# Altium schematic sheet 03_GYROSCOPE.SchDoc: GYRO
size A4; Author: Gabriel; Organization: Altium Limited; Address1: L3, 12a Rodborough Rd; Address2: Frenchs Forest; Address3: NSW; Address4: Australia 2086; Revision: v2.0; SheetNumber: 3; SheetTotal: 8; Subtitle: XDRONE
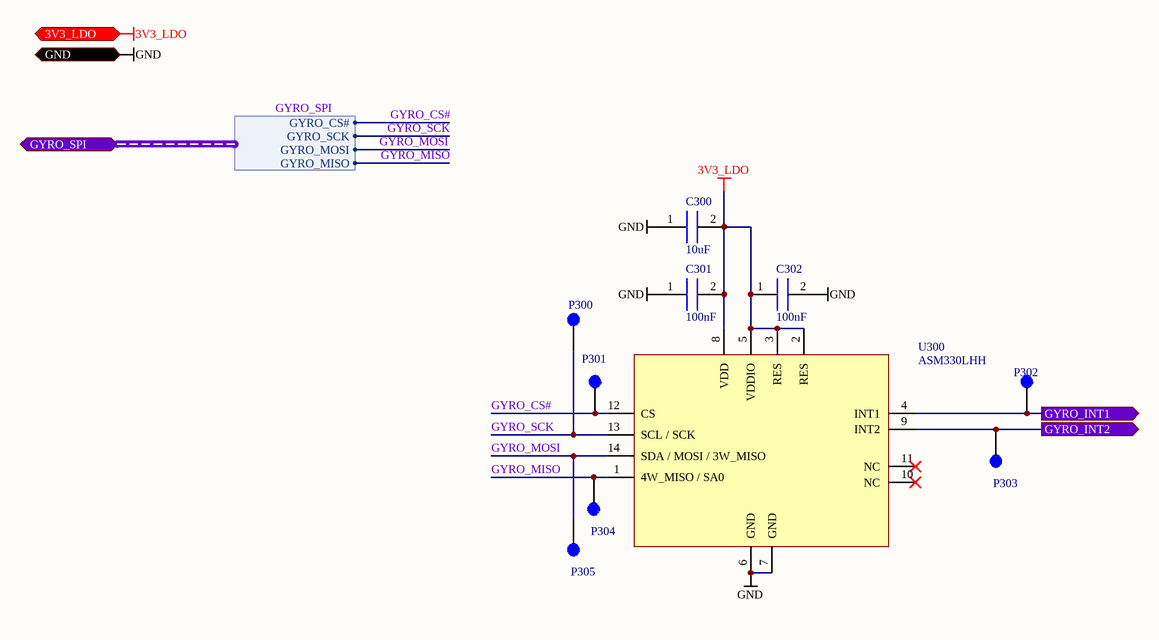
[diagram p0: 03_GYROSCOPE.SchDoc]

## Parts
C300  value 10uF  [CAP_0402]  (hidden comment: 10uF_20%_6.3V_0402_GRM155R60J106ME05D)
C301  value 100nF  [CAP_0402]  (hidden comment: 100nF_10%_16V_0402_GRM155R71C104KA88J)
C302  value 100nF  [CAP_0402]  (hidden comment: 100nF_10%_16V_0402_GRM155R71C104KA88J)
P300  TEST_POINT_2mm  [TEST_POINT_2mm]  (value not drawn)
P301  TEST_POINT_2mm  [TEST_POINT_2mm]  (value not drawn)
P302  TEST_POINT_2mm  [TEST_POINT_2mm]  (value not drawn)
P303  TEST_POINT_2mm  [TEST_POINT_2mm]  (value not drawn)
P304  TEST_POINT_2mm  [TEST_POINT_2mm]  (value not drawn)
P305  TEST_POINT_2mm  [TEST_POINT_2mm]  (value not drawn)
U300  MANUFACTURER REFERENCE: ASM330LHH  [LGA14]  (hidden comment: GYRO_3D_3.6V_ACEL_ASM330LHH)

## Ports
3V3_LDO (in), GND (in), GYRO_INT1 (out), GYRO_INT2 (out), GYRO_SPI (harness GYRO_SPI)

## Harnesses
GYRO_SPI: GYRO_CS#, GYRO_SCK, GYRO_MOSI, GYRO_MISO

## Nets
3V3_LDO: C300.2 C301.2 C302.1 U300.2(RES) U300.3(RES) U300.5(VDDIO) U300.8(VDD) ; port 3V3_LDO
GND: C300.1 C301.1 C302.2 U300.6(GND) U300.7(GND) ; port GND
GYRO_CS#: P301.1 U300.12(CS) ; port GYRO_SPI.GYRO_CS#
GYRO_INT1: P302.1 U300.4(INT1) ; port GYRO_INT1
GYRO_INT2: P303.1 U300.9(INT2) ; port GYRO_INT2
GYRO_MISO: P304.1 U300.1(4W_MISO_/_SA0) ; port GYRO_SPI.GYRO_MISO
GYRO_MOSI: P305.1 U300.14(SDA_/_MOSI_/_3W_MISO) ; port GYRO_SPI.GYRO_MOSI
GYRO_SCK: P300.1 U300.13(SCL_/_SCK) ; port GYRO_SPI.GYRO_SCK

Not connected (* = marked no-connect by the designer): U300 10(NC)* 11(NC)*

## Notes on the sheet
- TITLE:
- CREATED BY
- MODIFIED DATE
- REV
- PAGE
- /

## Library data of the parts
C300 = 10uF 20% 6.3V 0402 GRM155R60J106ME05D: CAPACITOR 10uF 20% 6.3V 0402 GRM155R60J106ME05D; MANUFACTURER: MURATA; DIELECTRIC: X5R; TOLERANCE: 20%; VOLTAGE RATING: 6.3V; PACKAGING: 0402; MOUNTING: SMD; MANUFACTURER REFERENCE: GRM155R60J106ME05D
C301 C302 = 100nF_10%_16V_0402_GRM155R71C104KA88J: CAPACITOR 100nF 10% X7R 0402; MANUFACTURER: MURATA; VOLTAGE RATING: 16V; DIELECTRIC: X7R; TOLERANCE: 10%; MOUNTING: SMD; MANUFACTURER REFERENCE: GRM155R71C104KA88J; PACKAGING: 0402
U300 = GYRO_3D_3.6V_ACEL_ASM330LHH: Gyroscope and accelerometer 3D 3.6V ASM330LHH; MANUFACTURER: ST; INPUT VOLTAGE MIN: 2V; INPUT VOLTAGE MAX: 3.6V; PACKAGING: 14-LGA; MOUNTING: SMD
P300-P305 = TEST_POINT_2mm: MOUNTING: SMD